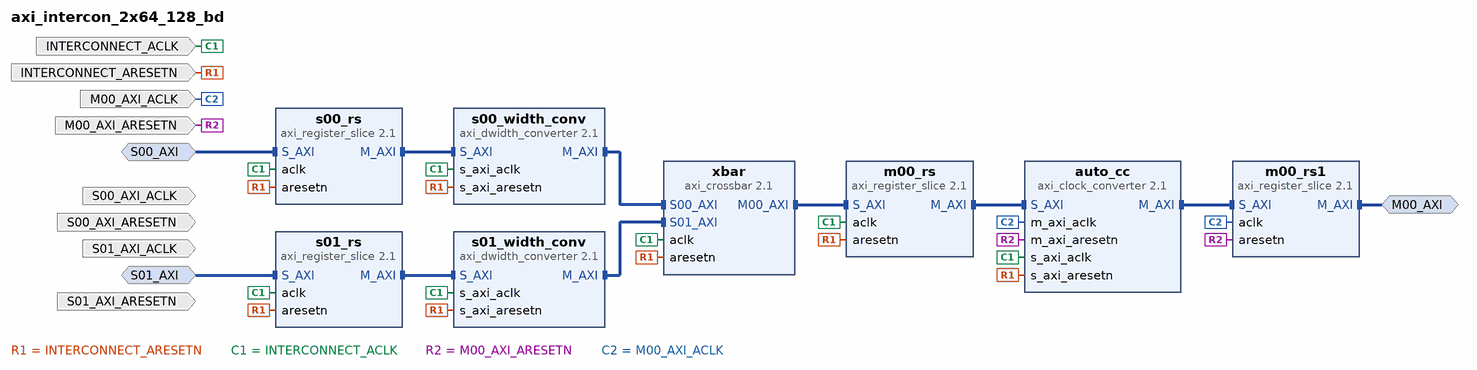
[diagram p0: block diagram of the top level]
# Vivado block design axi_intercon_2x64_128_bd, Vivado 2015.4
create_bd_design axi_intercon_2x64_128_bd

create_bd_intf_port -mode Slave -vlnv xilinx.com:interface:aximm_rtl:1.0 S01_AXI
set_property -dict [list \
  CONFIG.DATA_WIDTH 64 \
  CONFIG.PROTOCOL AXI4 \
  CONFIG.FREQ_HZ 100000000 \
  CONFIG.ID_WIDTH 1 \
  CONFIG.ADDR_WIDTH 32 \
  CONFIG.AWUSER_WIDTH 0 \
  CONFIG.ARUSER_WIDTH 0 \
  CONFIG.WUSER_WIDTH 0 \
  CONFIG.RUSER_WIDTH 0 \
  CONFIG.BUSER_WIDTH 0 \
  CONFIG.READ_WRITE_MODE READ_WRITE \
  CONFIG.HAS_BURST 1 \
  CONFIG.HAS_LOCK 1 \
  CONFIG.HAS_PROT 1 \
  CONFIG.HAS_CACHE 1 \
  CONFIG.HAS_QOS 1 \
  CONFIG.HAS_REGION 1 \
  CONFIG.HAS_WSTRB 1 \
  CONFIG.HAS_BRESP 1 \
  CONFIG.HAS_RRESP 1 \
  CONFIG.SUPPORTS_NARROW_BURST 1 \
  CONFIG.NUM_READ_OUTSTANDING 2 \
  CONFIG.NUM_WRITE_OUTSTANDING 2 \
  CONFIG.MAX_BURST_LENGTH 256 \
  CONFIG.PHASE 0.000 \
  CONFIG.CLK_DOMAIN axi_intercon_2x64_128_bd_ACLK \
] [get_bd_intf_ports S01_AXI]
create_bd_intf_port -mode Slave -vlnv xilinx.com:interface:aximm_rtl:1.0 S00_AXI
set_property -dict [list \
  CONFIG.DATA_WIDTH 64 \
  CONFIG.PROTOCOL AXI4 \
  CONFIG.FREQ_HZ 100000000 \
  CONFIG.ID_WIDTH 1 \
  CONFIG.ADDR_WIDTH 32 \
  CONFIG.AWUSER_WIDTH 0 \
  CONFIG.ARUSER_WIDTH 0 \
  CONFIG.WUSER_WIDTH 0 \
  CONFIG.RUSER_WIDTH 0 \
  CONFIG.BUSER_WIDTH 0 \
  CONFIG.READ_WRITE_MODE READ_WRITE \
  CONFIG.HAS_BURST 1 \
  CONFIG.HAS_LOCK 1 \
  CONFIG.HAS_PROT 1 \
  CONFIG.HAS_CACHE 1 \
  CONFIG.HAS_QOS 1 \
  CONFIG.HAS_REGION 1 \
  CONFIG.HAS_WSTRB 1 \
  CONFIG.HAS_BRESP 1 \
  CONFIG.HAS_RRESP 1 \
  CONFIG.SUPPORTS_NARROW_BURST 1 \
  CONFIG.NUM_READ_OUTSTANDING 2 \
  CONFIG.NUM_WRITE_OUTSTANDING 2 \
  CONFIG.MAX_BURST_LENGTH 256 \
  CONFIG.PHASE 0.000 \
  CONFIG.CLK_DOMAIN axi_intercon_2x64_128_bd_ACLK \
] [get_bd_intf_ports S00_AXI]
create_bd_intf_port -mode Master -vlnv xilinx.com:interface:aximm_rtl:1.0 M00_AXI
set_property -dict [list \
  CONFIG.DATA_WIDTH 256 \
  CONFIG.PROTOCOL AXI4 \
  CONFIG.ADDR_WIDTH 32 \
  CONFIG.NUM_READ_OUTSTANDING 2 \
  CONFIG.NUM_WRITE_OUTSTANDING 2 \
  CONFIG.CLK_DOMAIN axi_intercon_2x64_128_bd_M00_ACLK \
] [get_bd_intf_ports M00_AXI]
create_bd_port -dir I -type clk S01_AXI_ACLK
set_property -dict [list \
  CONFIG.CLK_DOMAIN axi_intercon_2x64_128_bd_S01_ACLK \
  CONFIG.ASSOCIATED_RESET S01_AXI_ARESETN \
] [get_bd_ports S01_AXI_ACLK]
create_bd_port -dir I -type clk S00_AXI_ACLK
set_property -dict [list \
  CONFIG.FREQ_HZ 1000000000 \
  CONFIG.CLK_DOMAIN axi_intercon_2x64_128_bd_S00_ACLK \
  CONFIG.ASSOCIATED_RESET S00_AXI_ARESETN \
] [get_bd_ports S00_AXI_ACLK]
create_bd_port -dir I -type rst S01_AXI_ARESETN
create_bd_port -dir I -type rst S00_AXI_ARESETN
create_bd_port -dir I -type rst INTERCONNECT_ARESETN
create_bd_port -dir I -type clk INTERCONNECT_ACLK
set_property -dict [list \
  CONFIG.CLK_DOMAIN axi_intercon_2x64_128_bd_ACLK \
  CONFIG.ASSOCIATED_BUSIF S01_AXI:S00_AXI \
  CONFIG.ASSOCIATED_RESET INTERCONNECT_ARESETN \
] [get_bd_ports INTERCONNECT_ACLK]
create_bd_port -dir I -type rst M00_AXI_ARESETN
create_bd_port -dir I -type clk M00_AXI_ACLK
set_property -dict [list \
  CONFIG.CLK_DOMAIN axi_intercon_2x64_128_bd_M00_ACLK \
  CONFIG.ASSOCIATED_RESET M00_AXI_ARESETN \
] [get_bd_ports M00_AXI_ACLK]

create_bd_cell -type ip -vlnv xilinx.com:ip:axi_dwidth_converter:2.1 s00_width_conv
set_property -dict [list \
  CONFIG.SI_DATA_WIDTH 64 \
  CONFIG.MI_DATA_WIDTH 256 \
  CONFIG.SI_ID_WIDTH 1 \
  CONFIG.FIFO_MODE 1 \
  CONFIG.SYNCHRONIZATION_STAGES 3 \
] [get_bd_cells s00_width_conv]
create_bd_cell -type ip -vlnv xilinx.com:ip:axi_dwidth_converter:2.1 s01_width_conv
set_property -dict [list \
  CONFIG.SI_DATA_WIDTH 64 \
  CONFIG.MI_DATA_WIDTH 256 \
  CONFIG.SI_ID_WIDTH 1 \
  CONFIG.FIFO_MODE 1 \
  CONFIG.SYNCHRONIZATION_STAGES 3 \
] [get_bd_cells s01_width_conv]
create_bd_cell -type ip -vlnv xilinx.com:ip:axi_crossbar:2.1 xbar
set_property -dict [list \
  CONFIG.NUM_SI 2 \
  CONFIG.NUM_MI 1 \
  CONFIG.STRATEGY 2 \
  CONFIG.DATA_WIDTH 256 \
  CONFIG.ID_WIDTH 1 \
  CONFIG.S01_BASE_ID 0x00000001 \
  CONFIG.S02_BASE_ID 0x00000002 \
  CONFIG.S03_BASE_ID 0x00000003 \
  CONFIG.S04_BASE_ID 0x00000004 \
  CONFIG.S05_BASE_ID 0x00000005 \
  CONFIG.S06_BASE_ID 0x00000006 \
  CONFIG.S07_BASE_ID 0x00000007 \
  CONFIG.S08_BASE_ID 0x00000008 \
  CONFIG.S09_BASE_ID 0x00000009 \
  CONFIG.S10_BASE_ID 0x0000000a \
  CONFIG.S11_BASE_ID 0x0000000b \
  CONFIG.S12_BASE_ID 0x0000000c \
  CONFIG.S13_BASE_ID 0x0000000d \
  CONFIG.S14_BASE_ID 0x0000000e \
  CONFIG.S15_BASE_ID 0x0000000f \
] [get_bd_cells xbar]
create_bd_cell -type ip -vlnv xilinx.com:ip:axi_register_slice:2.1 m00_rs
set_property -dict {CONFIG.DATA_WIDTH 256 CONFIG.ID_WIDTH 1 CONFIG.REG_AW 1 CONFIG.REG_AR 1 CONFIG.REG_B 1} [get_bd_cells m00_rs]
create_bd_cell -type ip -vlnv xilinx.com:ip:axi_register_slice:2.1 s01_rs
set_property -dict [list \
  CONFIG.DATA_WIDTH 64 \
  CONFIG.ID_WIDTH 1 \
  CONFIG.REG_AW 1 \
  CONFIG.REG_AR 1 \
  CONFIG.REG_R 1 \
  CONFIG.REG_W 1 \
  CONFIG.REG_B 1 \
] [get_bd_cells s01_rs]
create_bd_cell -type ip -vlnv xilinx.com:ip:axi_register_slice:2.1 s00_rs
set_property -dict [list \
  CONFIG.DATA_WIDTH 64 \
  CONFIG.ID_WIDTH 1 \
  CONFIG.REG_AW 1 \
  CONFIG.REG_AR 1 \
  CONFIG.REG_R 1 \
  CONFIG.REG_W 1 \
  CONFIG.REG_B 1 \
] [get_bd_cells s00_rs]
create_bd_cell -type ip -vlnv xilinx.com:ip:axi_clock_converter:2.1 auto_cc
set_property -dict {CONFIG.ID_WIDTH 1 CONFIG.ACLK_ASYNC 1 CONFIG.SYNCHRONIZATION_STAGES 3} [get_bd_cells auto_cc]
create_bd_cell -type ip -vlnv xilinx.com:ip:axi_register_slice:2.1 m00_rs1
set_property -dict {CONFIG.DATA_WIDTH 256 CONFIG.ID_WIDTH 1 CONFIG.REG_AW 1 CONFIG.REG_AR 1 CONFIG.REG_B 1} [get_bd_cells m00_rs1]

# ---- connections ----

connect_bd_intf_net [get_bd_intf_pins m00_rs/S_AXI] [get_bd_intf_pins xbar/M00_AXI]
connect_bd_intf_net [get_bd_intf_pins s00_width_conv/M_AXI] [get_bd_intf_pins xbar/S00_AXI]
connect_bd_intf_net [get_bd_intf_pins s01_width_conv/M_AXI] [get_bd_intf_pins xbar/S01_AXI]
connect_bd_intf_net [get_bd_intf_pins s01_rs/M_AXI] [get_bd_intf_pins s01_width_conv/S_AXI]
connect_bd_intf_net [get_bd_intf_pins s00_rs/M_AXI] [get_bd_intf_pins s00_width_conv/S_AXI]
connect_bd_intf_net [get_bd_intf_pins m00_rs/M_AXI] [get_bd_intf_pins auto_cc/S_AXI]
connect_bd_intf_net [get_bd_intf_pins auto_cc/M_AXI] [get_bd_intf_pins m00_rs1/S_AXI]
connect_bd_intf_net [get_bd_intf_ports S01_AXI] [get_bd_intf_pins s01_rs/S_AXI]
connect_bd_intf_net [get_bd_intf_ports S00_AXI] [get_bd_intf_pins s00_rs/S_AXI]
connect_bd_intf_net [get_bd_intf_ports M00_AXI] [get_bd_intf_pins m00_rs1/M_AXI]
connect_bd_net -net m_axi_aresetn_1 [get_bd_ports INTERCONNECT_ARESETN] \
  [get_bd_pins xbar/aresetn] [get_bd_pins m00_rs/aresetn] [get_bd_pins s01_rs/aresetn] [get_bd_pins s00_rs/aresetn] \
  [get_bd_pins s01_width_conv/s_axi_aresetn] [get_bd_pins s00_width_conv/s_axi_aresetn] [get_bd_pins auto_cc/s_axi_aresetn]
connect_bd_net -net ACLK_1 [get_bd_ports INTERCONNECT_ACLK] \
  [get_bd_pins xbar/aclk] [get_bd_pins m00_rs/aclk] [get_bd_pins s01_rs/aclk] [get_bd_pins s00_rs/aclk] \
  [get_bd_pins s01_width_conv/s_axi_aclk] [get_bd_pins s00_width_conv/s_axi_aclk] [get_bd_pins auto_cc/s_axi_aclk]
connect_bd_net [get_bd_ports M00_AXI_ARESETN] [get_bd_pins auto_cc/m_axi_aresetn] [get_bd_pins m00_rs1/aresetn]
connect_bd_net [get_bd_ports M00_AXI_ACLK] [get_bd_pins auto_cc/m_axi_aclk] [get_bd_pins m00_rs1/aclk]

# ---- address map ----
assign_bd_address -offset 0x00000000 -range 32M -target_address_space [get_bd_addr_spaces S00_AXI] [get_bd_addr_segs M00_AXI/Reg]
assign_bd_address -offset 0x02000000 -range 32M -target_address_space [get_bd_addr_spaces S01_AXI] [get_bd_addr_segs M00_AXI/Reg]

validate_bd_design
save_bd_design
